# EasyEDA schematic miniFOC-Sensor_schematic.json
TITLE: miniFOC-Sensor; REV: 1.0.1; Date: 2021-08-23; Sheet: 1/1; Drawn By: Acme_LaoZhu; Company: AcmeTech
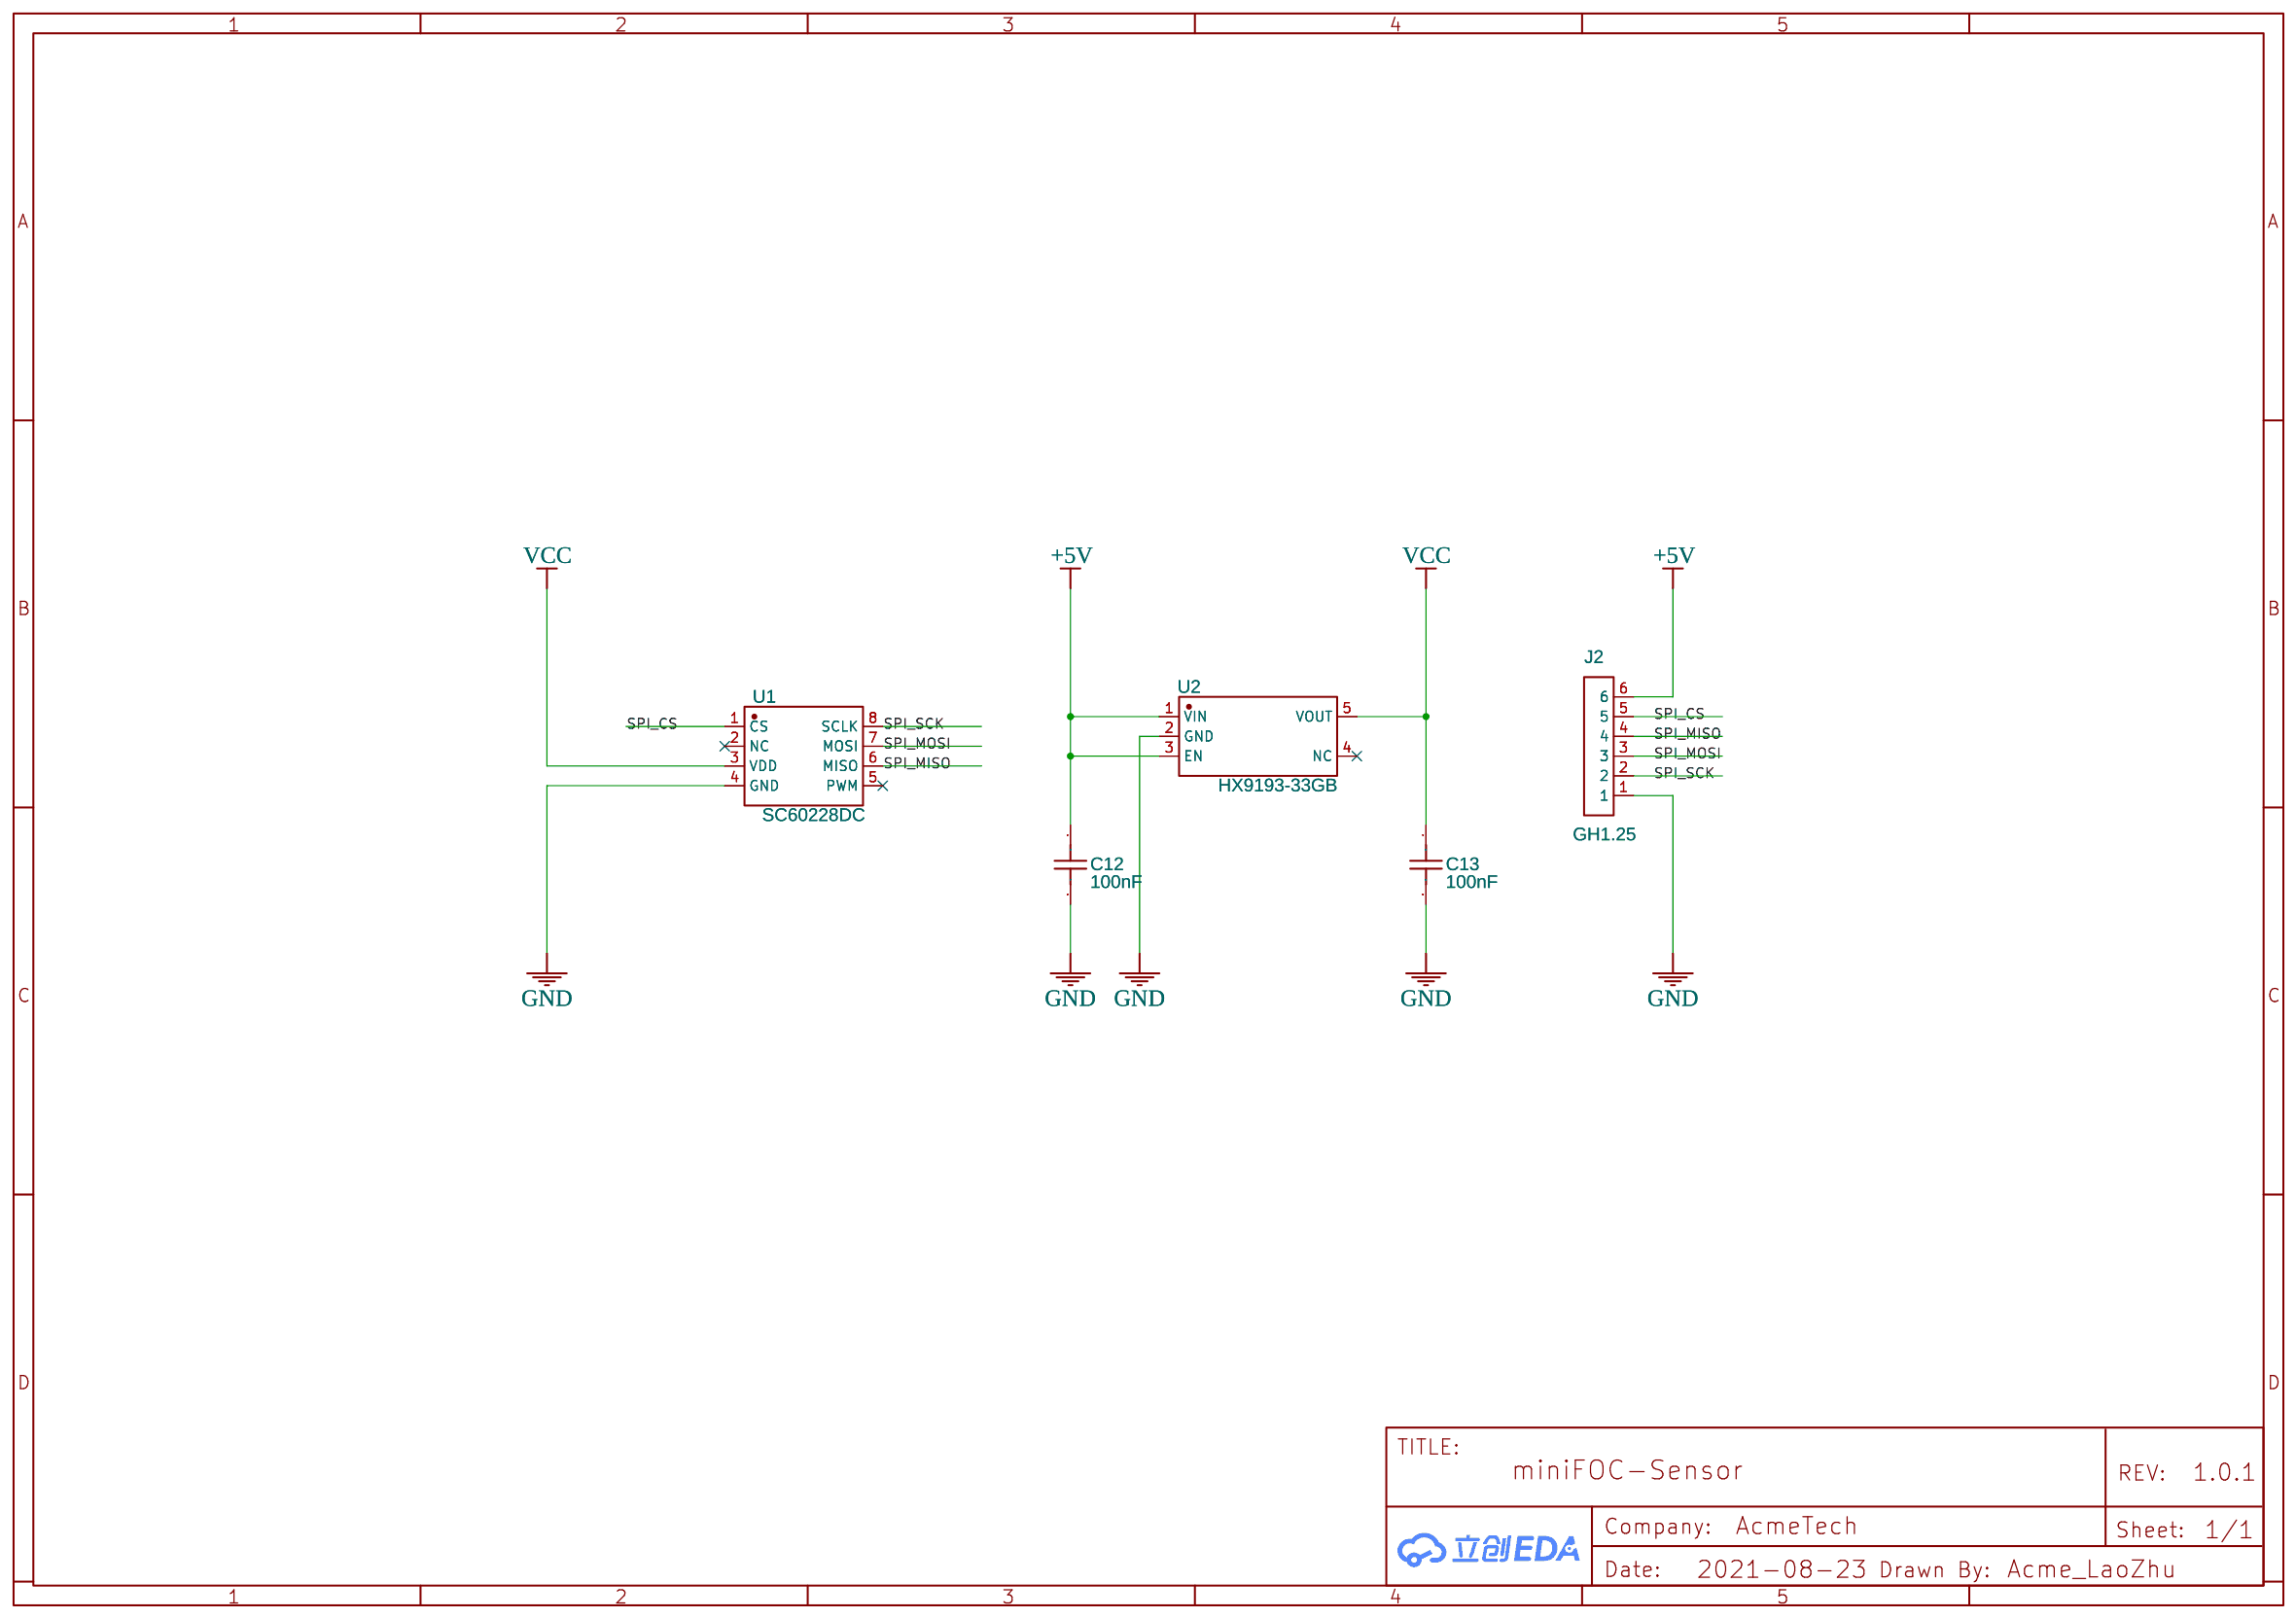
[diagram p0: schematic sheet]

## Parts
C12  100nF  [C0603]
C13  100nF  [C0603]
J2  GH1.25  [GH1.25_6P_卧贴]
U1  SC60228DC  [SOIC-8_L5.0-W4.0-P1.27-LS6.0-BL]
U2  HX9193-33GB  [SOT-23-5_L3.0-W1.7-P0.95-LS2.8-BR]

## Library data of the parts
C12 C13 = CC0603KRX7R9BB104: Supplier: LCSC; Manufacturer: YAGEO; Supplier Part: C14663; JLCPCB Part Class: Basic Part
J2 = GH1.25_6P: Manufacturer: Changjiang Connectors; Supplier: LCSC; Supplier Part: C225129; Contributor: SmartFish
U1 = SC60228DC: Supplier: LCSC; Supplier Part: C496752; Manufacturer: Semiment; Contributor: LCSC; JLCPCB Part Class: Extended Part
U2 = HX9193-33GB: Supplier: LCSC; Supplier Part: C296123; Manufacturer: hengjiaxing; Contributor: LCSC; JLCPCB Part Class: Extended Part

## Nets
+5V: C12.1 J2.6 U2.1(VIN) U2.3(EN)
GND: C12.2 C13.2 J2.1 U1.4(GND) U2.2(GND)
VCC: C13.1 U1.3(VDD) U2.5(VOUT)
SPI_CS: J2.5 U1.1(CS)
SPI_MISO: J2.4 U1.6(MISO)
SPI_MOSI: J2.3 U1.7(MOSI)
SPI_SCK: J2.2 U1.8(SCLK)

Not connected (* = marked no-connect by the designer): U1 2(NC)* 5(PWM)*; U2 4(NC)*
